# Altium schematic sheet Peripherals.SchDoc
size A
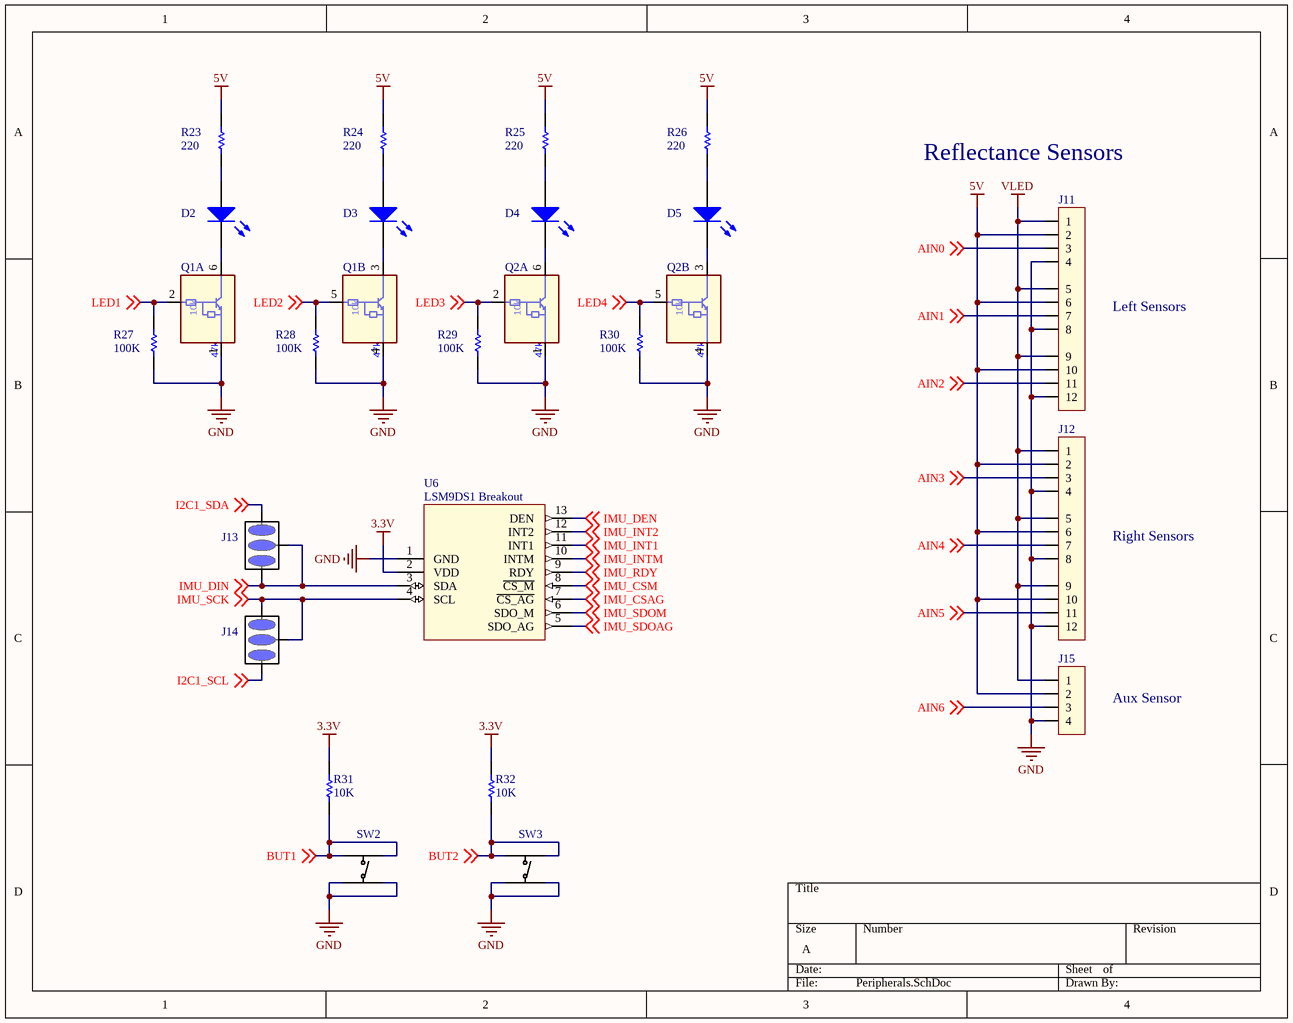
[diagram p0: Peripherals.SchDoc]

## Parts
D2  LED  [0603-DI-GREEN]  (value not drawn)
D3  LED  [0603-DI-GREEN]  (value not drawn)
D4  LED  [0603-DI-GREEN]  (value not drawn)
D5  LED  [0603-DI-GREEN]  (value not drawn)
J11  CONN_4x3  [CONN_4x3]  (value not drawn)
J12  CONN_4x3  [CONN_4x3]  (value not drawn)
J13  JUMPER_3  [JUMPER_3]  (value not drawn)
J14  JUMPER_3  [JUMPER_3]  (value not drawn)
J15  CONN_4x1  [HDR1X4]  (value not drawn)
Q1  RN1907  [SOT363-6L]  (value not drawn)  (parts A,B of 2)
Q2  RN1907  [SOT363-6L]  (value not drawn)  (parts A,B of 2)
R23  value 220  [J1-0603]
R24  value 220  [J1-0603]
R25  value 220  [J1-0603]
R26  value 220  [J1-0603]
R27  value 100K  [J1-0603]
R28  value 100K  [J1-0603]
R29  value 100K  [J1-0603]
R30  value 100K  [J1-0603]
R31  value 10K  [J1-0603]
R32  value 10K  [J1-0603]
SW2  TACT SWITCH  [TACT SWITCH]  (value not drawn)
SW3  TACT SWITCH  [TACT SWITCH]  (value not drawn)
U6  LSM9DS1 Breakout  [LSM9DS1 Breakout]

## Nets
3.3V: R31.1 R32.1 U6.2(VDD)
5V: J11.2 J11.6 J11.10 J12.2 J12.6 J12.10 J15.2 R23.2 R24.2 R25.2 R26.2
GND: J11.4 J11.8 J11.12 J12.4 J12.8 J12.12 J15.4 Q1.1 Q1.4 Q2.1 Q2.4 R27.1 R28.1 R29.1 R30.1 SW2.3 SW2.4 SW3.3 SW3.4 U6.1(GND)
VLED: J11.1 J11.5 J11.9 J12.1 J12.5 J12.9 J15.1
AIN0: J11.3 ; off-sheet AIN0
AIN1: J11.7 ; off-sheet AIN1
AIN2: J11.11 ; off-sheet AIN2
AIN3: J12.3 ; off-sheet AIN3
AIN4: J12.7 ; off-sheet AIN4
AIN5: J12.11 ; off-sheet AIN5
AIN6: J15.3 ; off-sheet AIN6
BUT1: R31.2 SW2.1 SW2.2 ; off-sheet BUT1
BUT2: R32.2 SW3.1 SW3.2 ; off-sheet BUT2
I2C1_SCL: J14.1 ; off-sheet I2C1_SCL
I2C1_SDA: J13.3 ; off-sheet I2C1_SDA
IMU_CSAG: U6.7(~{CS_AG}) ; off-sheet IMU_CSAG
IMU_CSM: U6.8(~{CS_M}) ; off-sheet IMU_CSM
IMU_DEN: U6.13(DEN) ; off-sheet IMU_DEN
IMU_DIN: J13.1 J13.2 U6.3(SDA) ; off-sheet IMU_DIN
IMU_INT1: U6.11(INT1) ; off-sheet IMU_INT1
IMU_INT2: U6.12(INT2) ; off-sheet IMU_INT2
IMU_INTM: U6.10(INTM) ; off-sheet IMU_INTM
IMU_RDY: U6.9(RDY) ; off-sheet IMU_RDY
IMU_SCK: J14.2 J14.3 U6.4(SCL) ; off-sheet IMU_SCK
IMU_SDOAG: U6.5(SDO_AG) ; off-sheet IMU_SDOAG
IMU_SDOM: U6.6(SDO_M) ; off-sheet IMU_SDOM
LED1: Q1.2 R27.2 ; off-sheet LED1
LED2: Q1.5 R28.2 ; off-sheet LED2
LED3: Q2.2 R29.2 ; off-sheet LED3
LED4: Q2.5 R30.2 ; off-sheet LED4
NetD2_1: D2.1(A) R23.1
NetD2_2: D2.2(K) Q1.6
NetD3_1: D3.1(A) R24.1
NetD3_2: D3.2(K) Q1.3
NetD4_1: D4.1(A) R25.1
NetD4_2: D4.2(K) Q2.6
NetD5_1: D5.1(A) R26.1
NetD5_2: D5.2(K) Q2.3

## Notes on the sheet
- Reflectance Sensors
- Left Sensors
- Right Sensors
- Aux Sensor
- (in symbol RN1907, part A) 10k; 47k
- (in symbol RN1907, part B) 10k; 47k

## Library data of the parts
D2-D5 = LED: LED BLUE CLEAR CHIP SMD; Published: 8-Jun-2000; LatestRevisionDate: 17-Jul-2002; LatestRevisionNote: Re-released for DXP Platform.; PackageVersion: Feb-2002; PackageReference: 3.2X1.6X1.1; Publisher: Altium Limited; PackageDescription: SM LED; 2 Flat Leads; Supplier Part Number 1: 160-1647-1-ND; Supplier 1: Digi-Key
J11 J12 = CONN_4x3: CONN HEADER R/A 12POS 2.54MM; Supplier Part Number 1: SAM8998-ND; Supplier 1: Digi-Key
Q1 Q2 = RN1907: TRANS 2NPN PREBIAS 0.2W US6; Supplier Part Number 1: RN1907LF(CTCT-ND; Supplier 1: Digi-Key
R23-R26 = Res1: RES SMD 220 OHM 5% 1/10W 0603; Supplier Part Number 1: 311-220GRCT-ND; Supplier 1: Digi-Key
R27-R30 = Res1: RES SMD 100K OHM 5% 1/10W 0603; Supplier Part Number 1: 311-100KGRCT-ND; Supplier 1: Digi-Key
R31 R32 = Res1: RES SMD 10K OHM 5% 1/10W 0603; Supplier Part Number 1: 311-10KGRCT-ND; Supplier 1: Digi-Key
SW2 SW3 = TACT SWITCH: SWITCH TACTILE SPST-NO 0.05A 12V; Manufacturer: C&K; Manufacturer Part Number: PTS645SL50SMTR92 LFS; Switch Function: Off-Mom; Contact Rating @ Voltage: 0.05A @ 12VDC; Actuator Type: Standard; Actuator Height off PCB, Vertical: 5.00mm; Actuator Orientation: Top Actuated; Outline: 6.00mm x 6.00mm; Illumination: Non-Illuminated; Operating Force: 130gf; Actuator Material: Polyamide (PA66), Nylon 6/6; Mechanical Life: 100,000 Cycles; Supplier 1: Digi-Key; RoHS: RoHS Compliant; Category: Switches; Stock 1: 42939; Pricing 1: 1=0.22, 10=0.215, 25=0.2076, 50=0.2002, 100=0.1891, 250=0.17796, 500=0.17054 (USD); Packaging: Cut Tape (CT); Part Status: Active; Circuit: SPST-NO; Mounting Type: Surface Mount; Actuator Length, Right Angle: -; Termination Style: Gull Wing; Illumination Type, Color: -; Illumination Voltage (Nominal): -; Ingress Protection: -; Features: -; Operating Temperature: -20°C ~ 60°C; Switch Travel: -; ComponentLink1URL: https://www.ckswitches.com/media/1471/pts645.pdf; ComponentLink1Description: https://www.ckswitches.com/media/1471/pts645.pdf; Supplier Part Number 1: CKN9088CT-ND
U6 = LSM9DS1 Breakout: SPARKFUN 9 DEGREES OF FREEDOM IM; Supplier Part Number 1: 1568-1257-ND; Supplier 1: Digi-Key